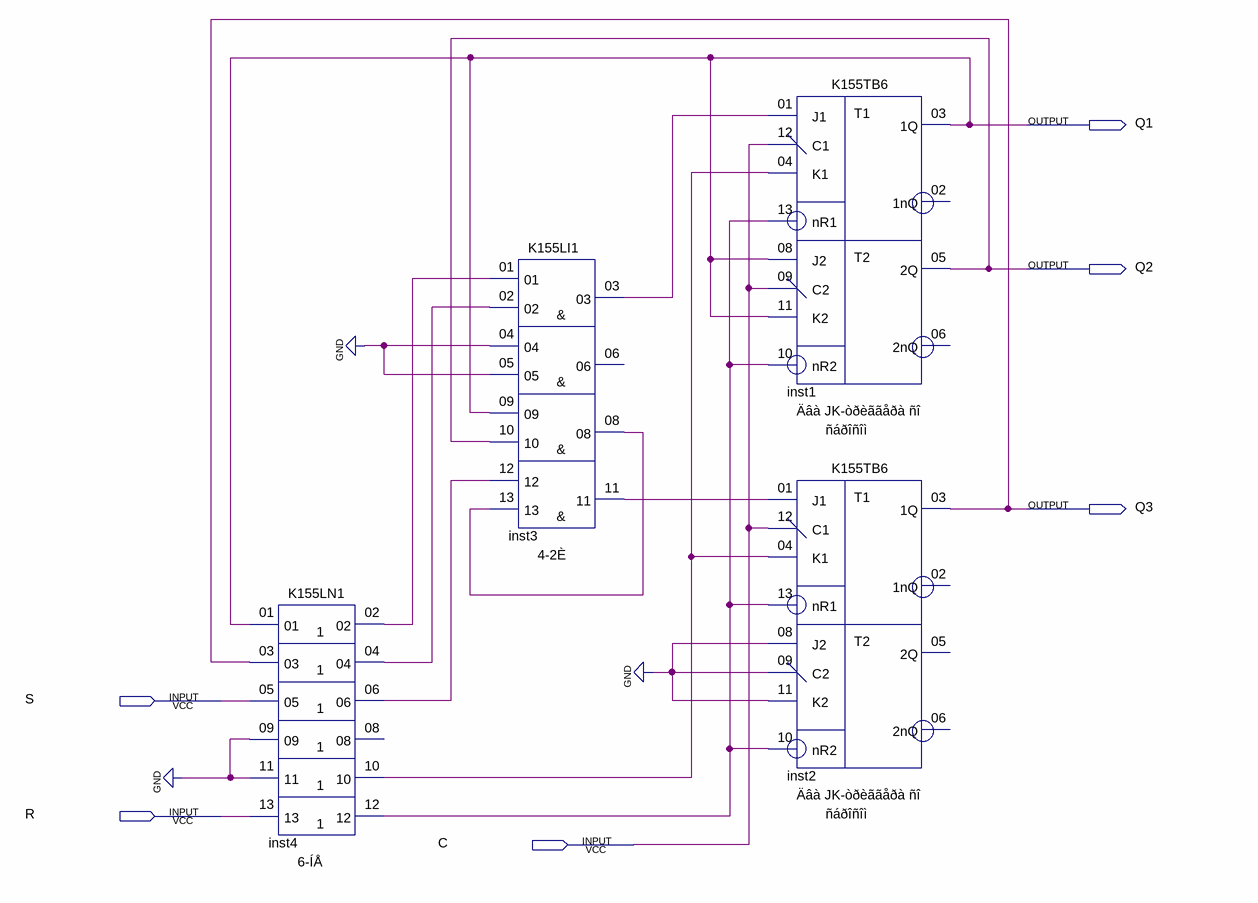
[diagram p0: schematic sheet]
// Quartus schematic scheme.bdf as structural Verilog: 4 symbols, 6 pins
module scheme (
  input  S,
  input  R,
  input  C,
  output Q1,
  output Q2,
  output Q3
);

  wire inst3_03, inst3_08, inst3_11, inst4_02, inst4_04, inst4_06, inst4_10, inst4_12;

  K155LN1 inst4 (
    .\01 (Q1), .\03 (Q3), .\05 (S), .\09 (1'b0), .\11 (1'b0), .\13 (R), .\02 (inst4_02), .\04 (inst4_04),
    .\06 (inst4_06), .\10 (inst4_10), .\12 (inst4_12));  // open: 08
  K155LI1 inst3 (
    .\01 (inst4_02), .\02 (inst4_04), .\04 (1'b0), .\05 (1'b0), .\09 (Q1), .\10 (Q2), .\12 (inst4_06),
    .\13 (inst3_08), .\03 (inst3_03), .\08 (inst3_08), .\11 (inst3_11));  // open: 06
  K155TB6 inst1 (
    .J1(inst3_03), .nR1(inst4_12), .C1(C), .K1(inst4_10), .J2(Q1), .nR2(inst4_12), .C2(C), .K2(Q1),
    .\1Q (Q1), .\2Q (Q2));  // open: 1nQ, 2nQ
  K155TB6 inst2 (
    .J1(inst3_11), .nR1(inst4_12), .C1(C), .K1(inst4_10), .J2(1'b0), .nR2(inst4_12), .C2(1'b0), .K2(1'b0),
    .\1Q (Q3));  // open: 1nQ, 2Q, 2nQ
endmodule
